# Altium schematic sheet Cover.SchDoc
size A3; ApprovedBy: GITHUB; CheckedBy: DSM; DocumentNumber: 1; Revision: 1; SheetNumber: 1; SheetTotal: 5; PreparedBy: Onur KARADUMAN; ChangedDate: 20/11/2021; ReleaseDate: 18/09/2022; Size: A3; Description: Wireless Security; Department: R&D - Hardware
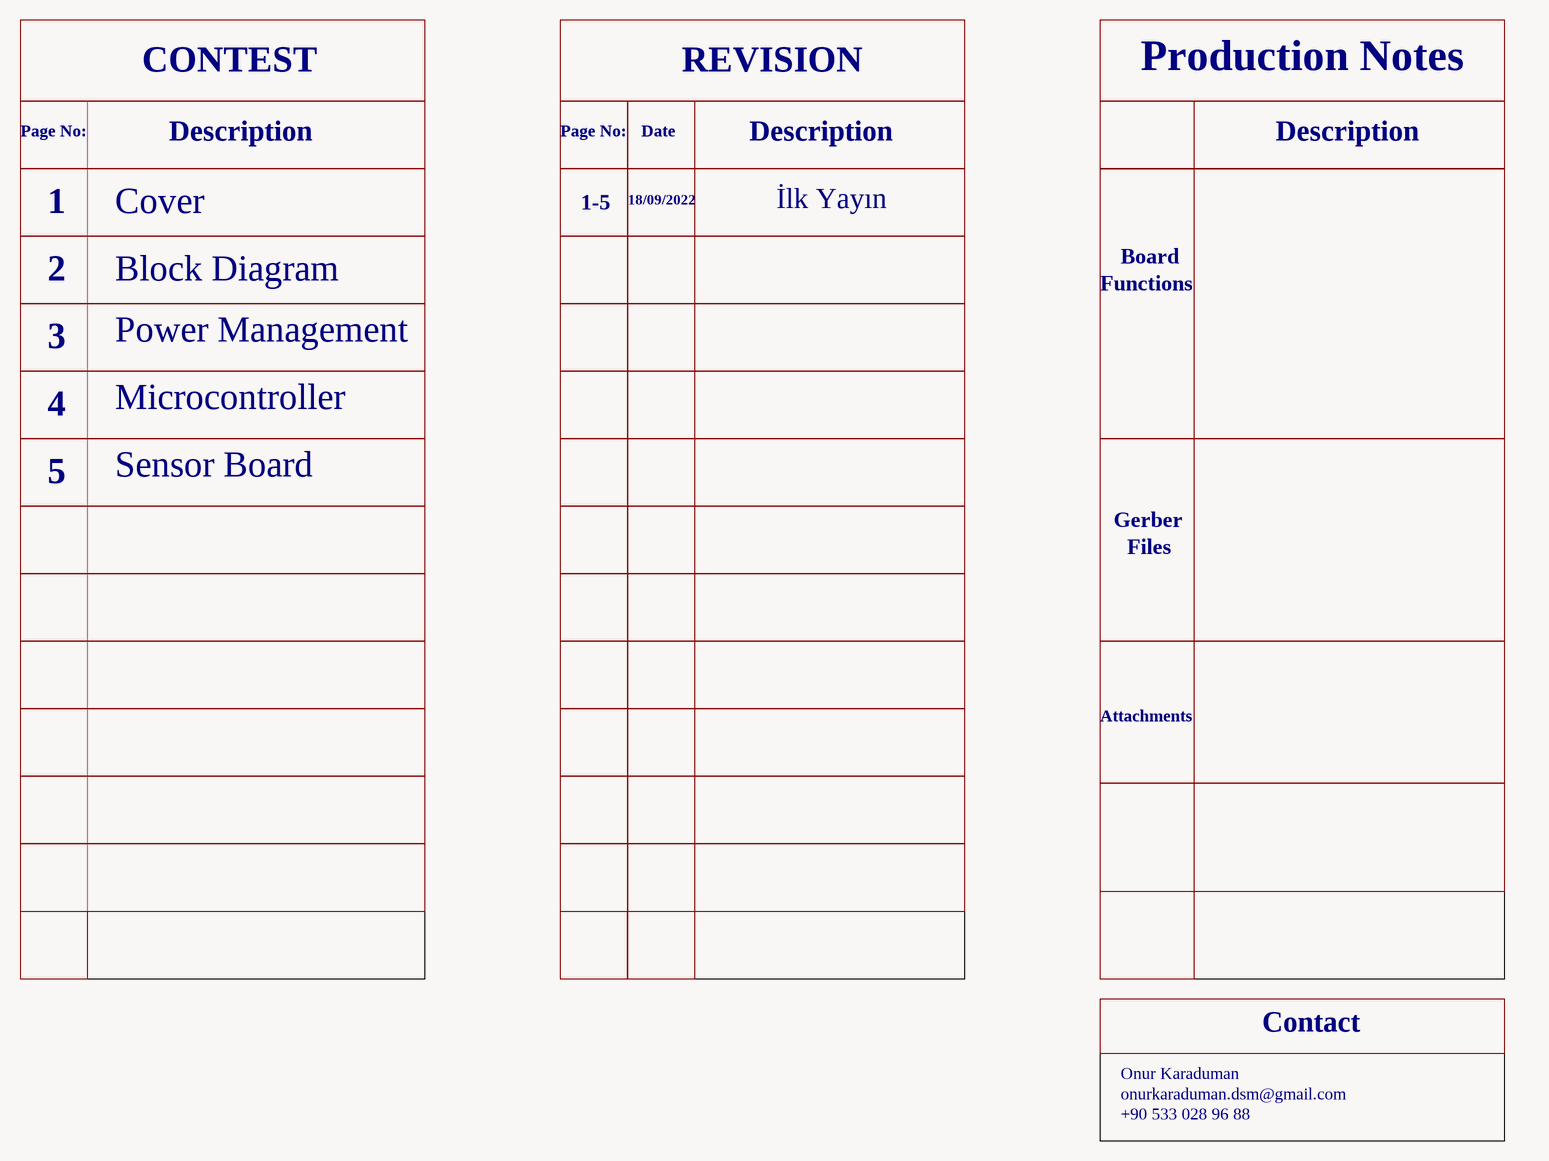
[diagram p0: Cover.SchDoc]

## Notes on the sheet
- CONTEST
- REVISION
- Production Notes
- Page No:
- Description
- Date
- 1
- Cover
- 1-5
- 18/09/2022
- İlk Yayın
- Board
- 2
- Block Diagram
- Functions
- 3
- Power Management
- 4
- Microcontroller
- 5
- Sensor Board
- Gerber
- Files
- Attachments
- Onur Karaduman
- Contact
- onurkaraduman.dsm@gmail.com
- +90 533 028 96 88
- DOSYA ADI / FILE NAME
- TANIM / DESCRIPTION
- HAZIRLAYAN / PREPARED BY
- YAYIN TAR.İHİ / REL. DATE
- KONTROL EDEN / CHECKED BY
- DEĞ. TARİHİ / CHANGE DATE
- ONAYLAYAN / APPROVED BY
- BÖLÜM / DEPARTMENT
- REVİZE / REVISION
- BOYUT / SIZE
- SAYFA / SHEET
- /